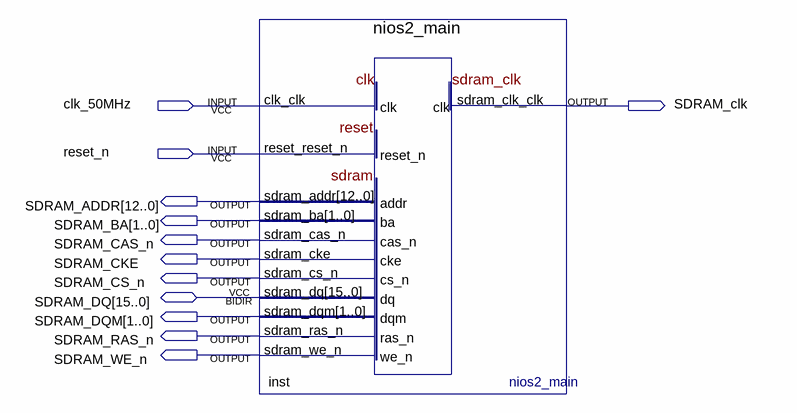
[diagram p0: schematic sheet]
// Quartus schematic dvs18_g7.bdf as structural Verilog: 1 symbols, 12 pins
module dvs18_g7 (
  input  clk_50MHz,
  input  reset_n,
  inout  [15:0] SDRAM_DQ,
  output SDRAM_clk,
  output [12:0] SDRAM_ADDR,
  output [1:0] SDRAM_BA,
  output SDRAM_CAS_n,
  output SDRAM_CKE,
  output SDRAM_CS_n,
  output [1:0] SDRAM_DQM,
  output SDRAM_RAS_n,
  output SDRAM_WE_n
);

  nios2_main inst (
    .clk_clk(clk_50MHz), .reset_reset_n(reset_n), .sdram_addr(SDRAM_ADDR), .sdram_ba(SDRAM_BA),
    .sdram_cas_n(SDRAM_CAS_n), .sdram_cke(SDRAM_CKE), .sdram_cs_n(SDRAM_CS_n), .sdram_dqm(SDRAM_DQM),
    .sdram_ras_n(SDRAM_RAS_n), .sdram_we_n(SDRAM_WE_n), .sdram_clk_clk(SDRAM_clk), .sdram_dq(SDRAM_DQ));
endmodule
